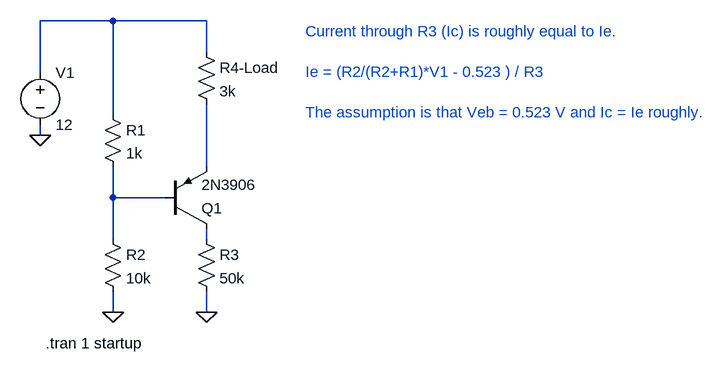
[diagram p0: schematic Current-source-BJT.asc]
Current-source-BJT.asc, the LTspice schematic file:
Version 4.1
SHEET 1 1388 680
WIRE 48 -96 -64 -96
WIRE 192 -96 48 -96
WIRE 192 -48 192 -96
WIRE -64 -16 -64 -96
WIRE 48 48 48 -96
WIRE -64 80 -64 64
WIRE 192 128 192 32
WIRE 48 176 48 128
WIRE 128 176 48 176
WIRE 48 240 48 176
WIRE 192 240 192 224
WIRE 48 352 48 320
WIRE 192 352 192 320
FLAG 192 352 0
FLAG 48 352 0
FLAG -64 80 0
SYMBOL res 32 32 R0
SYMATTR InstName R1
SYMATTR Value 1k
SYMBOL res 32 224 R0
SYMATTR InstName R2
SYMATTR Value 10k
SYMBOL res 176 224 R0
SYMATTR InstName R3
SYMATTR Value 50k
SYMBOL res 176 -64 R0
SYMATTR InstName R4-Load
SYMATTR Value 3k
SYMBOL voltage -64 -32 R0
WINDOW 123 0 0 Left 0
WINDOW 39 0 0 Left 0
SYMATTR InstName V1
SYMATTR Value 12
SYMBOL pnp 128 224 M180
SYMATTR InstName Q1
SYMATTR Value 2N3906
TEXT -56 400 Left 2 !.tran 1 startup
TEXT 344 -80 Left 2 ;Current through R3 (Ic) is roughly equal to Ie.\n \nIe = (R2/(R2+R1)*V1 - 0.523 ) / R3\n \nThe assumption is that Veb = 0.523 V and Ic = Ie roughly.

The netlist it stands for:
* Current-source-BJT.asc
R1 N001 N003 1k
R2 N003 0 10k
R3 N004 0 50k
R4-Load N001 N002 3k
V1 N001 0 12
Q1 N004 N003 N002 0 2N3906
.model NPN NPN
.model PNP PNP
.lib standard.bjt
.tran 1 startup
* Current through R3 (Ic) is roughly equal to Ie.
* Ie = (R2/(R2+R1)*V1 - 0.523 ) / R3
* The assumption is that Veb = 0.523 V and Ic = Ie roughly.
.backanno
.end